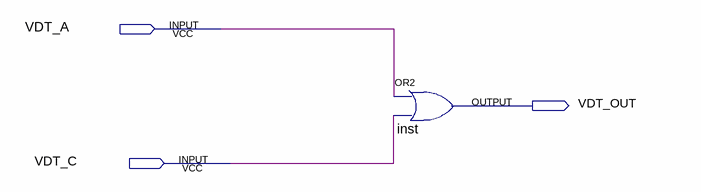
[diagram p0: schematic sheet]
// Quartus schematic assignment2a.bdf as structural Verilog: 1 symbols, 3 pins
module assignment2a (
  input  VDT_A,
  input  VDT_C,
  output VDT_OUT
);

  or inst (VDT_OUT, VDT_A, VDT_C);
endmodule
